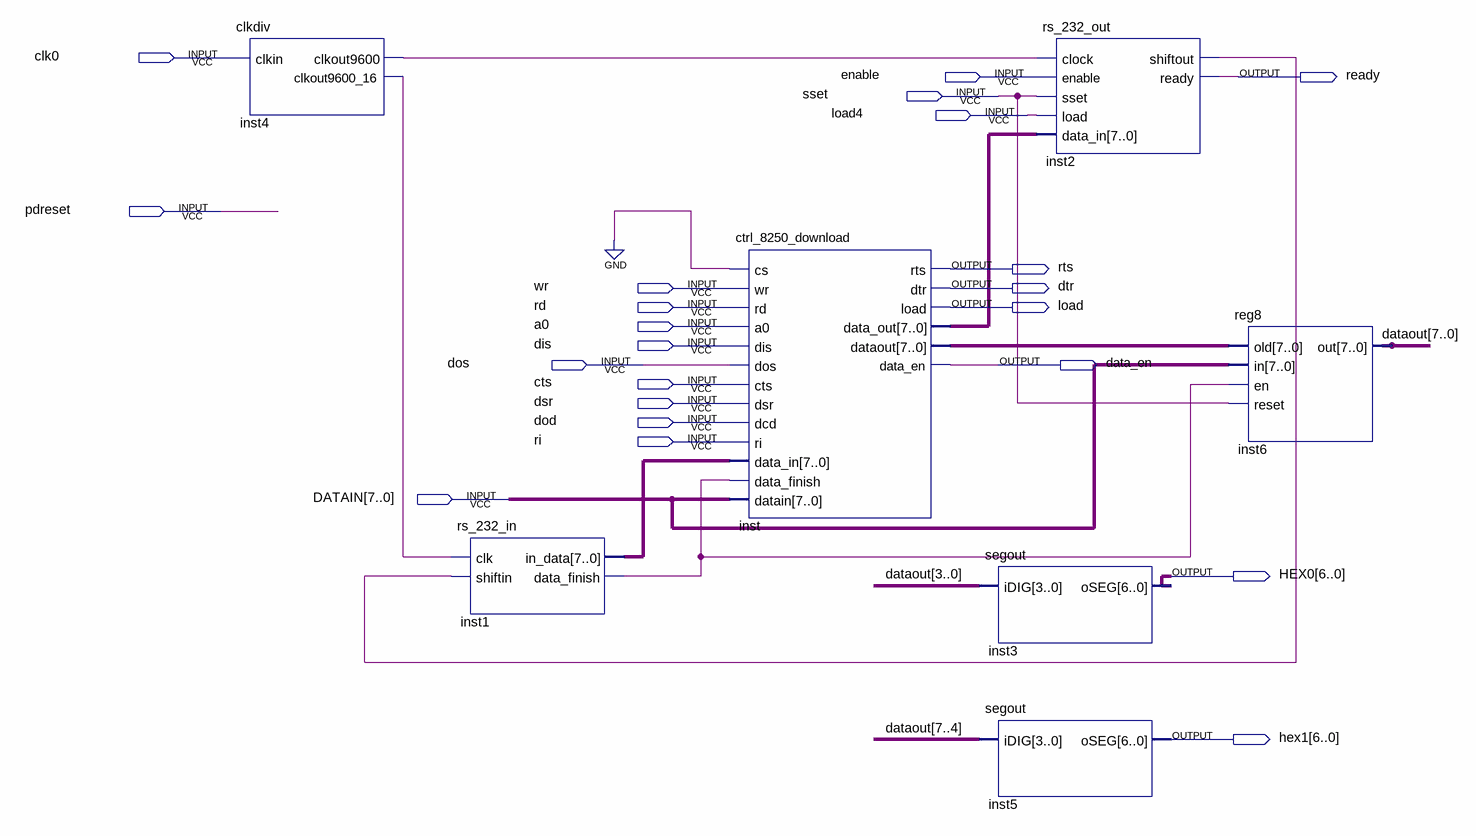
[diagram p0: schematic sheet]
// Quartus schematic 8250_down.bdf as structural Verilog: 7 symbols, 22 pins
module \8250_down  (
  input  clk0,
  input  enable,
  input  sset,
  input  load4,
  input  pdreset,
  input  wr,
  input  rd,
  input  a0,
  input  dis,
  input  dos,
  input  cts,
  input  dsr,
  input  dod,
  input  ri,
  input  [7:0] DATAIN,
  output ready,
  output rts,
  output dtr,
  output load,
  output data_en,
  output [6:0] HEX0,
  output [6:0] hex1
);

  wire inst1_data_finish, inst2_shiftout, inst4_clkout9600, inst4_clkout9600_16;
  wire [7:0] dataout, inst1_in_data, inst_data_out, inst_dataout;

  clkdiv inst4 (.clkin(clk0), .clkout9600(inst4_clkout9600), .clkout9600_16(inst4_clkout9600_16));
  rs_232_in inst1 (
    .clk(inst4_clkout9600_16), .shiftin(inst2_shiftout), .in_data(inst1_in_data),
    .data_finish(inst1_data_finish));
  ctrl_8250_download inst (
    .cs(1'b0), .wr(wr), .rd(rd), .a0(a0), .dis(dis), .dos(dos), .cts(cts), .dsr(dsr), .dcd(dod), .ri(ri),
    .data_in(inst1_in_data), .data_finish(inst1_data_finish), .datain(DATAIN), .rts(rts), .dtr(dtr),
    .load(load), .data_out(inst_data_out), .dataout(inst_dataout), .data_en(data_en));
  segout inst3 (.iDIG(dataout[3:0]), .oSEG(HEX0));
  segout inst5 (.iDIG(dataout[7:4]), .oSEG(hex1));
  rs_232_out inst2 (
    .clock(inst4_clkout9600), .enable(enable), .sset(sset), .load(load4), .data_in(inst_data_out),
    .shiftout(inst2_shiftout), .ready(ready));
  reg8 inst6 (.old(inst_dataout), .in(DATAIN), .en(inst1_data_finish), .reset(sset), .out(dataout));
endmodule
